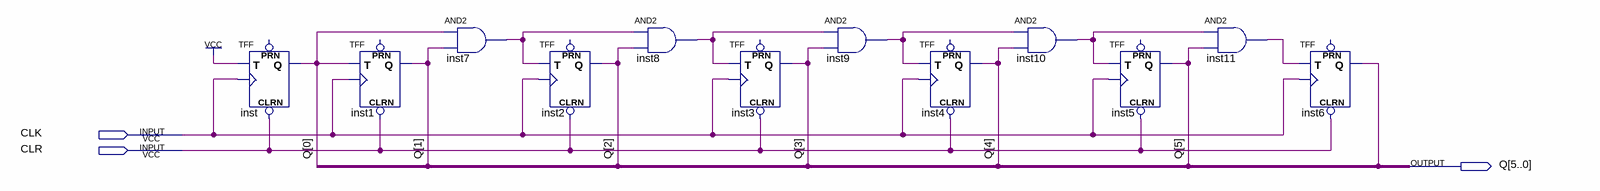
[diagram p0: schematic sheet]
// Quartus schematic 6bit_counter.bdf as structural Verilog: 12 symbols, 3 pins
module \6bit_counter  (
  input  CLK,
  input  CLR,
  output [5:0] Q
);

  wire inst6_q, inst7_out, inst8_out, inst9_out, inst10_out, inst11_out;

  TFF inst (.CLRN(CLR), .T(1'b1), .CLK(CLK), .Q(Q[0]));  // open: PRN
  TFF inst1 (.CLRN(CLR), .T(Q[0]), .CLK(CLK), .Q(Q[1]));  // open: PRN
  and inst7 (inst7_out, Q[0], Q[1]);
  TFF inst2 (.CLRN(CLR), .T(inst7_out), .CLK(CLK), .Q(Q[2]));  // open: PRN
  and inst8 (inst8_out, inst7_out, Q[2]);
  TFF inst3 (.CLRN(CLR), .T(inst8_out), .CLK(CLK), .Q(Q[3]));  // open: PRN
  and inst9 (inst9_out, inst8_out, Q[3]);
  TFF inst4 (.CLRN(CLR), .T(inst9_out), .CLK(CLK), .Q(Q[4]));  // open: PRN
  and inst10 (inst10_out, inst9_out, Q[4]);
  TFF inst5 (.CLRN(CLR), .T(inst10_out), .CLK(CLK), .Q(Q[5]));  // open: PRN
  and inst11 (inst11_out, inst10_out, Q[5]);
  TFF inst6 (.CLRN(CLR), .T(inst11_out), .CLK(CLK), .Q(inst6_q));  // open: PRN
endmodule
